# EAGLE design 2014_CANSAT_Power_Supply (EAGLE 6.5.0)
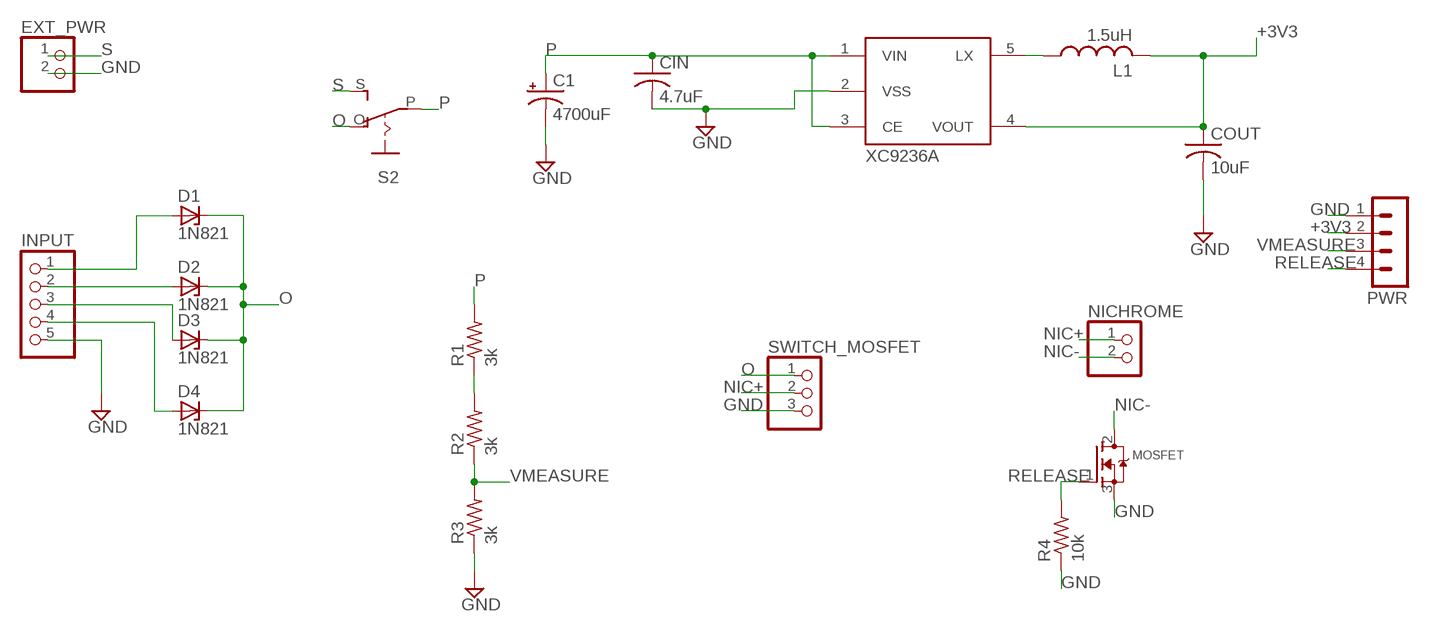
[diagram p0: schematic, sheet 1]

## Parts
C1  4700uF  CPOL-USE5-5  [E5-5]
CIN  4.7uF  C-US050-024X044  [C050-024X044]
COUT  10uF  C-US050-024X044  [C050-024X044]
D1  1N821  [DO35Z10]
D2  1N821  [DO35Z10]
D3  1N821  [DO35Z10]
D4  1N821  [DO35Z10]
EXT_PWR  PINHD-1X2  [1X02]
INPUT  PINHD-1X5  [1X05]
L1  1.5uH  L-US6000-XXX-RC  [6000-XXXX-RC]
MOSFET  MOSFET-NGDS_TO220V  [TO220V]
NICHROME  PINHD-1X2  [1X02]
PWR  MA04-1  [MA04-1]
R1  3k  R-US_0309/10  [0309/10]
R2  3k  R-US_0309/10  [0309/10]
R3  3k  R-US_0309/10  [0309/10]
R4  10k  R-US_0309/10  [0309/10]
S2  EG1218S  [EG1218]
SWITCH_MOSFET  PINHD-1X3  [1X03]
XC9236A  MCP73811/2  [SOT23-5L]

## Nets
+3V3: COUT.1 L1.2 PWR.2 XC9236A.4(VOUT)
GND: C1.- CIN.2 COUT.2 EXT_PWR.2 INPUT.5 MOSFET.3(S) PWR.1 R3.1 R4.1 SWITCH_MOSFET.3 XC9236A.2(VSS)
N$1: R1.1 R2.2
N$2: D1.A INPUT.1
N$3: D2.A INPUT.2
N$4: D3.A INPUT.3
N$5: L1.1 XC9236A.5(LX)
N$6: D4.A INPUT.4
NIC+: NICHROME.1 SWITCH_MOSFET.2
NIC-: MOSFET.2(D) NICHROME.2
O: D1.C D2.C D3.C D4.C S2.O SWITCH_MOSFET.1
P: C1.+ CIN.1 R1.2 S2.P XC9236A.1(VIN) XC9236A.3(CE)
RELEASE: MOSFET.1(G) PWR.4 R4.2
S: EXT_PWR.1 S2.S
VMEASURE: PWR.3 R2.1 R3.2

## Library data of the parts
C1 = resistor:CPOL-US: POLARIZED CAPACITOR, American symbol
CIN COUT = adafruit:C-US: CAPACITOR, American symbol
D1-D4 = diode:1N821: Reference DIODE temperature compensated, 6,2 V
EXT_PWR NICHROME = pinhead:PINHD-1X2: PIN HEADER
INPUT = pinhead:PINHD-1X5: PIN HEADER
L1 = rcl:L-US: INDUCTOR, American symbol
MOSFET = adafruit:MOSFET-N: N-Channel Mosfet 2N7002E - 60V 260mA SOT23 [Digikey: 2N7002ET1GOSTR-ND] - REEL BSH103 - 30V 850mA SOT23 [Digikey: 568-5013-1-ND]
PWR = con-lstb:MA04-1: PIN HEADER; OC_FARNELL: unknown; OC_NEWARK: unknown
R1-R4 = resistor:R-US_: RESISTOR, American symbol
S2 = adafruit:EG1218: SLIDING SWITCH 0.1" spacing through hole, vertical SPDT slide switch http://www.ladyada.net/library/pcb/eaglelibrary.html
SWITCH_MOSFET = pinhead:PINHD-1X3: PIN HEADER
XC9236A = adafruit:MCP73811/2: MCP73811 and MCP73812 Simple, Miniature Single-Cell, Fully Integrated Li-Ion / Li-Polymer Charge Management Controllers SOT-23-5 package, no indicator LED but with adjustable current, small and very inexpensive

## Net classes
0 default: width 0.305 mm, drill 0.508 mm, clearance 0.254 mm

## Board
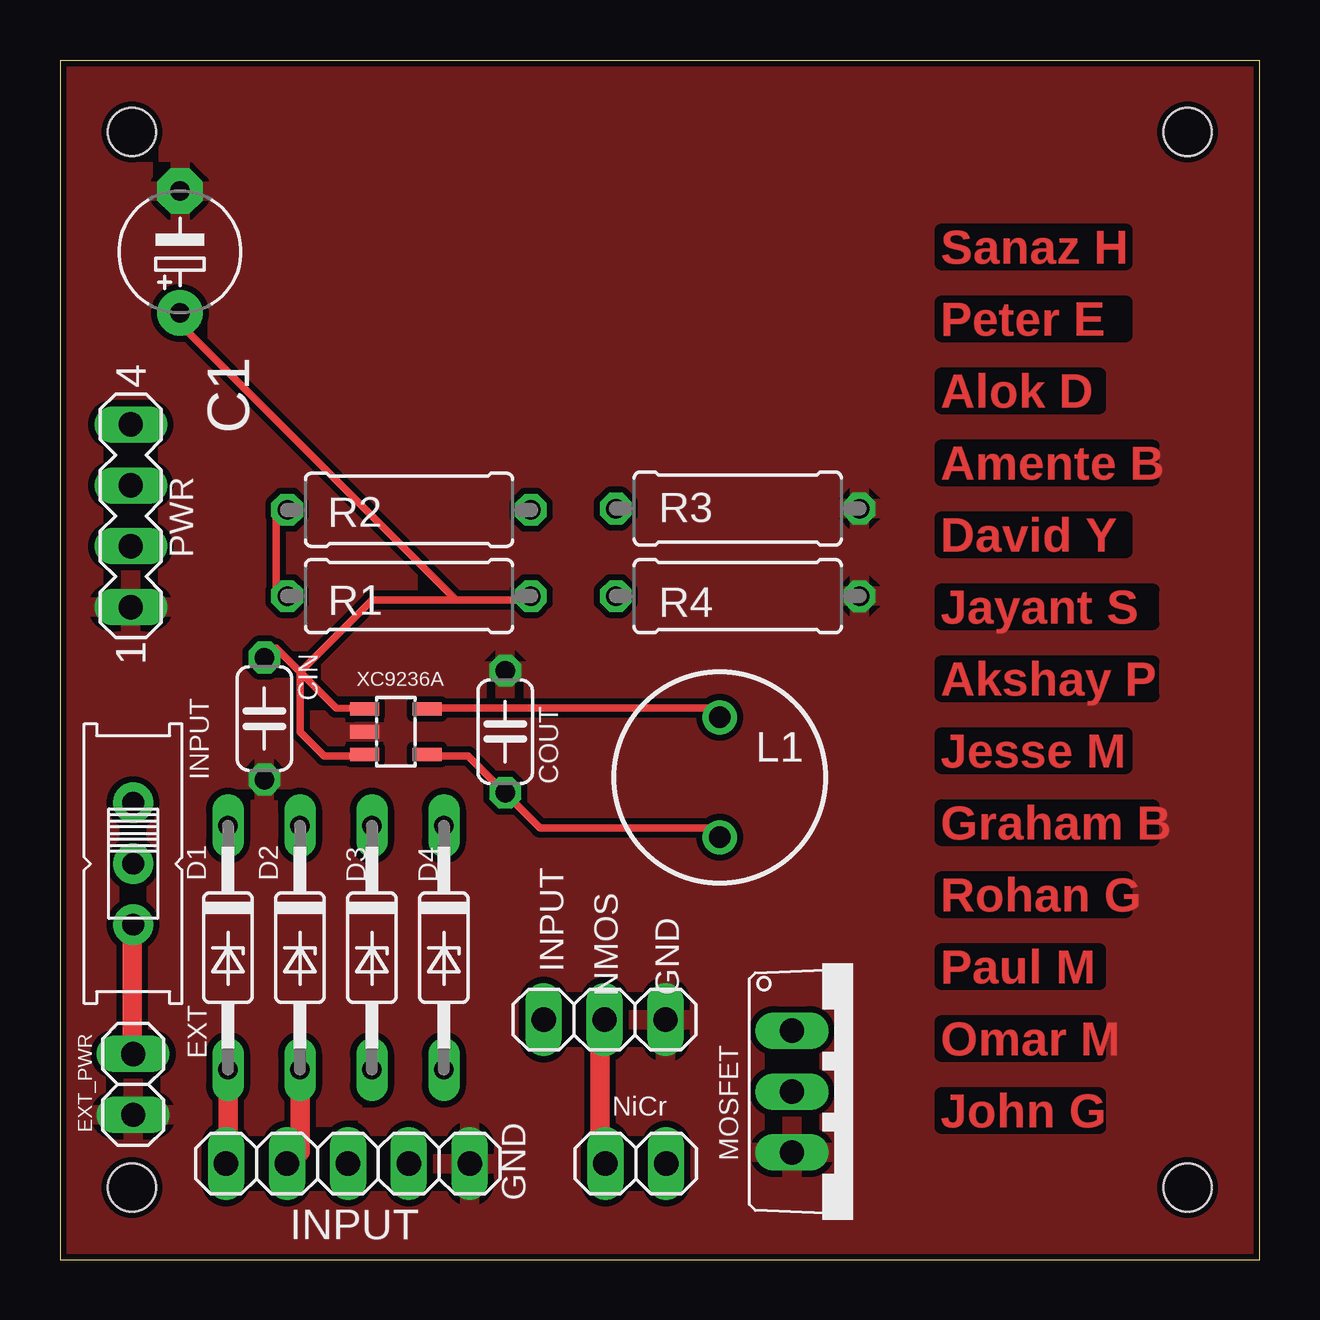
[diagram p1: board, top side]
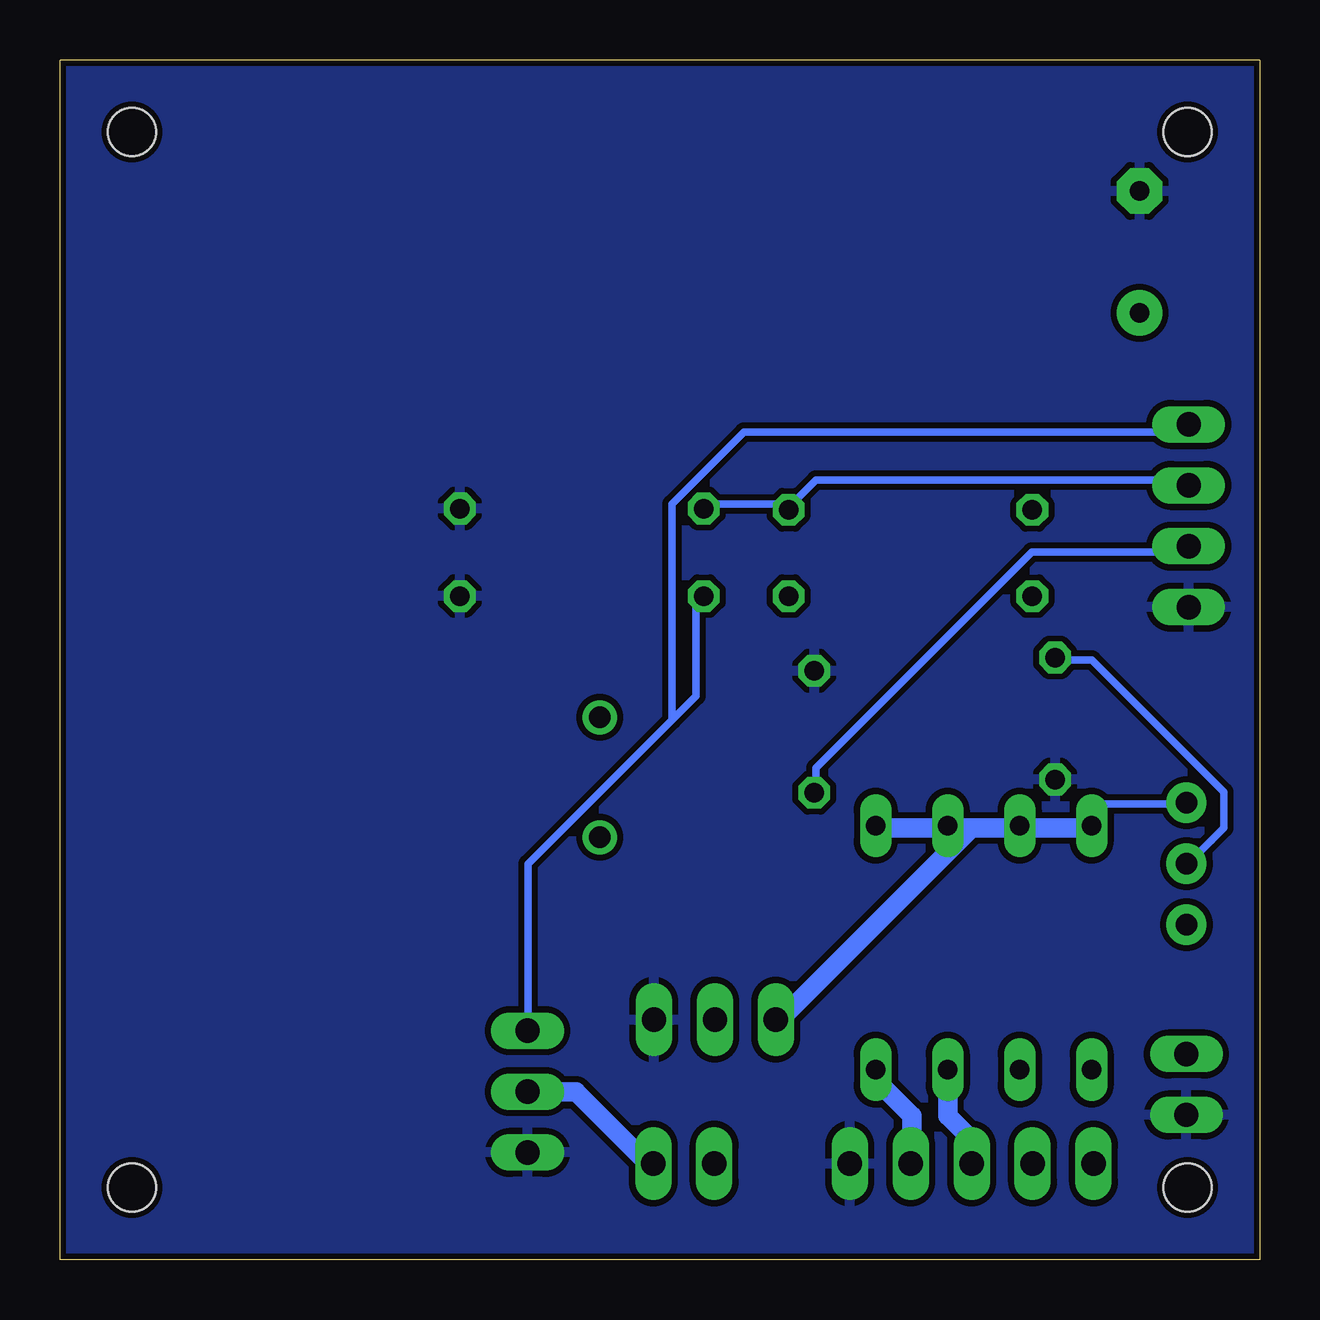
[diagram p2: board, bottom side, seen from below]

Size 50 x 50 mm. Coordinates in mm from the lower left corner, seen from the top.
Outline: 0,0 50,0 50,50 0,50 0,0
Copper layers (1*16): Top 0.035mm / dielectric 1.5mm / Bottom 0.035mm
Design rules "ITEADstudio_DRC": minimum track width 6mil, minimum drill 12mil, track to track 6mil, track to pad 6mil, pad to pad 6mil, via to via 6mil, smd to smd 0mil, copper to edge 10mil, drill to drill 10mil, minimum pad ring 10mil, minimum via ring 6mil, stop-mask expansion 2mil, vias tented up to drill 100mil, thermal gap 10mil
Holes 2 mm at 3,3 47,3 47,47 3,47
tKeepout: area 34,0 to 50,50; area 0,34 to 50,50

### Footprints (pad centres in the part's own frame; a part is rotated, then mirrored left to right if it is on the bottom)
E5-5 = drill 0.813 pad 1.905: + -2.54,0 | drill 0.813 pad 1.905 octagon: - 2.54,0
C050-024X044 = drill 0.813 octagon: 1 -2.54,0; 2 2.54,0
DO35Z10 = drill 0.813 long: A 5.08,0; C -5.08,0
1X02 = drill 1.016 long: 1 -1.27,0; 2 1.27,0
1X05 = drill 1.016 long: 1 -5.08,0; 2 -2.54,0; 3 0,0; 4 2.54,0; 5 5.08,0
6000-XXXX-RC = drill 0.9 pad 1.422: 1 -2.5,0; 2 2.5,0
TO220V = drill 1.016 long: 1 -2.54,-2.54; 2 0,-2.54; 3 2.54,-2.54
MA04-1 = drill 1.016 long: 1 -3.81,0; 2 -1.27,0; 3 1.27,0; 4 3.81,0
0309/10 = drill 0.813 octagon: 1 -5.08,0; 2 5.08,0
EG1218 = drill 0.9 pad 1.676: O -2.54,0; P 0,0; S 2.54,0
1X03 = drill 1.016 long: 1 -2.54,0; 2 0,0; 3 2.54,0
SOT23-5L = smd 0.55 x 1.2: 1 -0.95,-1.3; 2 0,-1.3; 3 0.95,-1.3; 4 0.95,1.3; 5 -0.95,1.3

### Placement (x,y rotation side)
C1  5,42 90 top
CIN  8.52,22.55 270 top
COUT  18.56,22 90 top
D1  7,13 270 top
D2  10,13 270 top
D3  13,13 270 top
D4  16,13 270 top
EXT_PWR  3.05,7.3 270 top
INPUT  12,4 0 top
L1  27.5,20.1 270 top
MOSFET  33.05,7 270 top
NICHROME  24,4 0 top
PWR  2.95,31 90 top
R1  14.55,27.65 0 top
R2  14.55,31.25 180 top
R3  28.25,31.3 180 top
R4  28.25,27.65 180 top
S2  3.05,16.5 270 top
SWITCH_MOSFET  22.7,10 0 top
XC9236A  14,22 270 top

### Tracks (layer width: path | path; a pad name or v marks a point on that pad's centre or on a via)
+3V3
  Top 0.305: XC9236A.4 15.5,21 17,21 18.5,19.5 COUT.1 19,19 20,18 27.5,18 L1.2
  Bottom 0.305: PWR.2 3,29.5 9.5,29.5 18.5,20.5 18.5,19.5 COUT.1
GND
  pour Top: -2,51 51,51 51,-1 -2.35,-1
  pour Bottom: -4,53 -4,-3 53,-3 53,53
N$1
  Top 0.305: R1.1 9,28 9,31 R2.2
N$2
  Top 0.305: 7,4 INPUT.1
  Top 0.813: 7,4 D1.A
N$3
  Top 0.305: 9.5,4 INPUT.2
  Top 0.813: D2.A 10,4.5 9.5,4
N$4
  Bottom 0.813: D3.A 13,6 12,5 INPUT.3
N$5
  Top 0.305: XC9236A.5 15.5,23 27.5,23 L1.1
N$6
  Bottom 0.305: 14.5,4 INPUT.4
  Bottom 0.813: 14.5,4 14.5,6 16,7.5 D4.A
NIC+
  Top 0.813: NICHROME.1 22.5,4 22.5,10 SWITCH_MOSFET.2
NIC-
  Bottom 0.305: 25.5,4 NICHROME.2
  Bottom 0.813: 25.5,4 28.5,7 MOSFET.2
O
  Bottom 0.305: 10,18 D2.C | 16,18 D4.C | 13,18 D3.C | 20,10 SWITCH_MOSFET.1 | S2.O 3.5,19 6.5,19 7,18.5 D1.C
  Bottom 0.813: D1.C 7,18 10,18 12,18 | 12,18 13,18 16,18 | 12,18 20,10
P
  Top 0.305: 10,24.5 9,25.5 CIN.1 | 10,24.5 11.5,23 XC9236A.1 | 16.5,27.5 13,27.5 10,24.5 | 16.5,27.5 19.5,27.5 R1.2 | 16.5,27.5 5,39 | 10,24.5 10,22 11,21 12.5,21 XC9236A.3
  Top 0.813: 5,39 C1.+
  Bottom 0.305: CIN.1 8.5,25 7,25 1.5,19.5 1.5,18 3,16.5 S2.P
RELEASE
  Bottom 0.305: 24.5,22.5 30.5,16.5 30.5,10 MOSFET.1 | 24.5,22.5 23.5,23.5 23.5,27.5 R4.2 | 24.5,22.5 24.5,31.5 21.5,34.5 3,34.5 PWR.4
S
  Top 0.813: EXT_PWR.1 3,9 3,13.5 S2.S
VMEASURE
  Bottom 0.305: R3.2 23,31.5 20,31.5 R2.1 19.5,31.5 18.5,32.5 3,32.5 PWR.3

### Text on the board
Top: Sanaz H | Peter E | Alok D | Amente B | David Y | Jayant S | Akshay P | Jesse M | Graham B | Rohan G | Paul M | Omar M | John G
tSilk: INPUT | NMOS | GND | INPUT | EXT | GND | NiCr